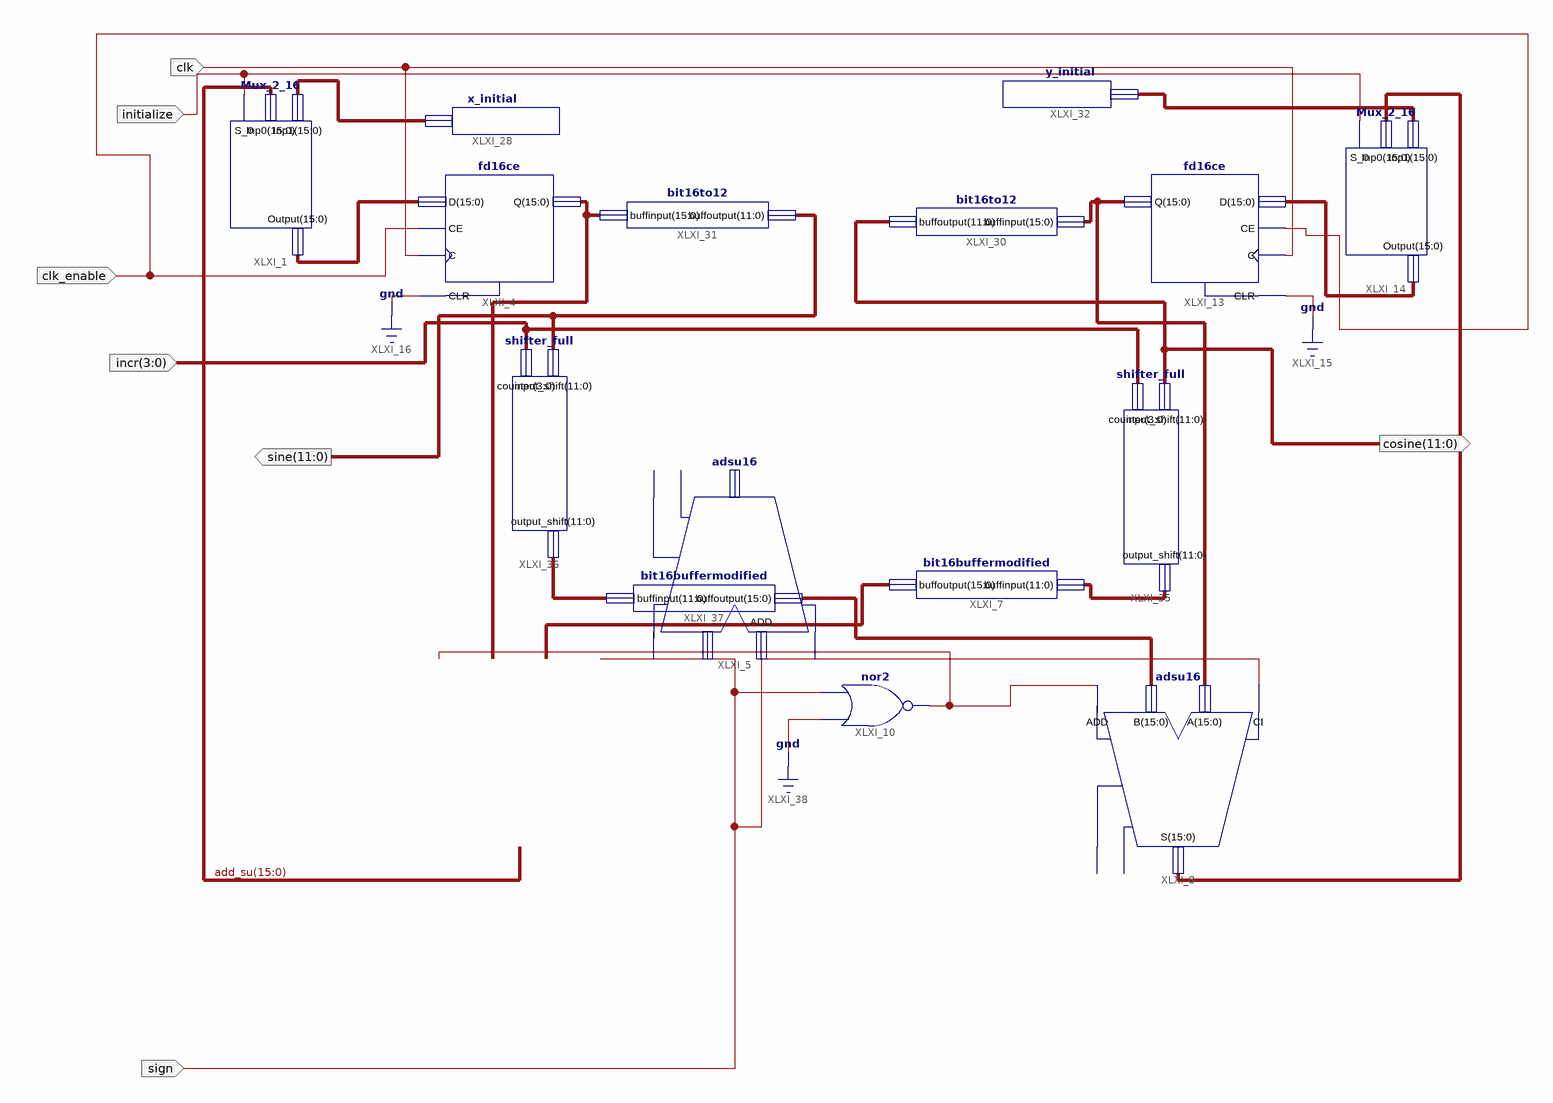
[diagram p0: schematic sheet 1]
// Xilinx ISE schematic SineCosine.sch (spartan3) as structural Verilog: 15 symbols, 7 ports
module SineCosine (
  input  sign,
  input  clk,
  input  clk_enable,
  input  [3:0] incr,
  input  initialize,
  output [11:0] sine,
  output [11:0] cosine
);

  wire XLXN_62;
  wire [11:0] XLXN_6, XLXN_61;
  wire [15:0] add_su, XLXN_1, XLXN_3, XLXN_5, XLXN_11, XLXN_14, XLXN_53, XLXN_56, XLXN_57, XLXN_60;

  Mux_2_16 XLXI_1 (.Inp1(XLXN_53), .Inp0(add_su), .S_0(initialize), .Output(XLXN_14));
  fd16ce XLXI_4 (.C(clk), .CE(clk_enable), .CLR(1'b0), .D(XLXN_14), .Q(XLXN_56));
  adsu16 XLXI_5 (.A(XLXN_56), .ADD(sign), .B(XLXN_3), .CI(XLXN_62), .S(add_su));  // open: CO, OFL
  bit16buffermodified XLXI_7 (.buffinput(XLXN_6), .buffoutput(XLXN_3));
  adsu16 XLXI_8 (.A(XLXN_57), .ADD(XLXN_62), .B(XLXN_1), .CI(sign), .S(XLXN_5));  // open: CO, OFL
  nor XLXI_10 (XLXN_62, 1'b0, sign);
  fd16ce XLXI_13 (.C(clk), .CE(clk_enable), .CLR(1'b0), .D(XLXN_11), .Q(XLXN_57));
  Mux_2_16 XLXI_14 (.Inp1(XLXN_60), .Inp0(XLXN_5), .S_0(initialize), .Output(XLXN_11));
  x_initial XLXI_28 (.x_constant(XLXN_53));
  bit16to12 XLXI_30 (.buffinput(XLXN_57), .buffoutput(cosine));
  bit16to12 XLXI_31 (.buffinput(XLXN_56), .buffoutput(sine));
  y_initial XLXI_32 (.x_constant(XLXN_60));
  shifter_full XLXI_35 (.input_shift(cosine), .counter(incr), .output_shift(XLXN_6));
  shifter_full XLXI_36 (.input_shift(sine), .counter(incr), .output_shift(XLXN_61));
  bit16buffermodified XLXI_37 (.buffinput(XLXN_61), .buffoutput(XLXN_1));
endmodule
